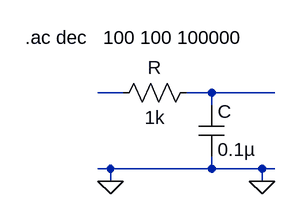
[diagram p0: schematic LPF.asc]
LPF.asc, the LTspice schematic file:
Version 4
SHEET 1 880 680
WIRE 112 128 80 128
WIRE 224 128 192 128
WIRE 304 128 224 128
WIRE 224 144 224 128
WIRE 96 224 80 224
WIRE 224 224 224 208
WIRE 224 224 96 224
WIRE 288 224 224 224
WIRE 304 224 288 224
WIRE 96 240 96 224
WIRE 288 240 288 224
FLAG 96 240 0
FLAG 288 240 0
SYMBOL cap 208 144 R0
SYMATTR InstName C
SYMATTR Value 0.1µ
SYMBOL res 208 112 R90
WINDOW 0 0 56 VBottom 2
WINDOW 3 32 56 VTop 2
SYMATTR InstName R
SYMATTR Value 1k
TEXT -12 58 Left 2 !.ac dec   100 100 100000

The netlist it stands for:
* LPF.asc
C N002 0 0.1µ
R N002 N001 1k
.ac dec   100 100 100000
.backanno
.end